# EAGLE design Joytick board single side (EAGLE 9.6.2)
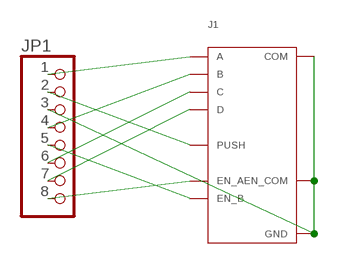
[diagram p0: schematic, sheet 1]

## Parts
J1  RKJXT1F42001  [RKJXT1F42001]
JP1  PINHD-1X08_2.54-SMD-90°  [1X08SMD/90]

## Nets
N$1: J1.A JP1.1
N$2: J1.PUSH JP1.2
N$3: J1.COM J1.ENCODER_COM(EN_COM) J1.GND JP1.3
N$4: J1.B JP1.4
N$5: J1.ENCODER_B(EN_B) JP1.5
N$6: J1.C JP1.6
N$7: J1.D JP1.7
N$8: J1.ENCODER_A(EN_A) JP1.8

## Library data of the parts
J1 = PP_Electromechanical:RKJXT1F42001
JP1 = pinhead-2:PINHD-1X08: PIN HEADER

## Board
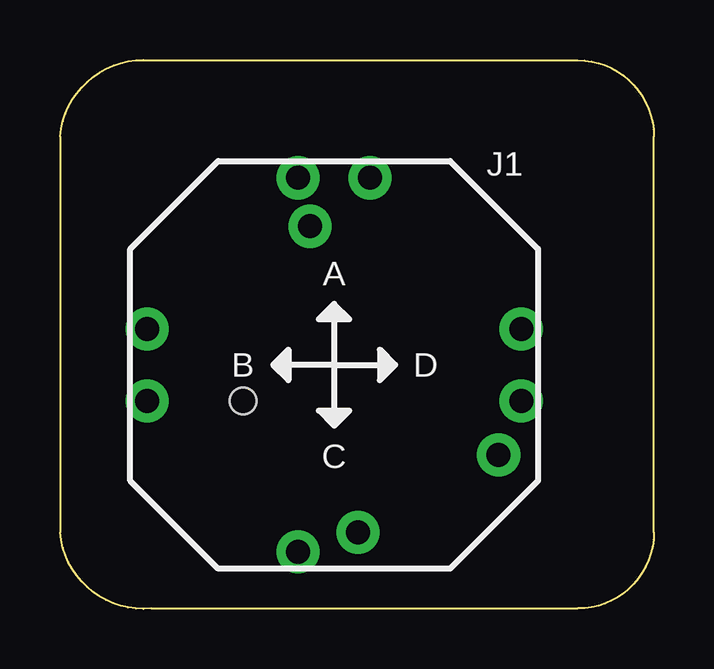
[diagram p1: board, top side]
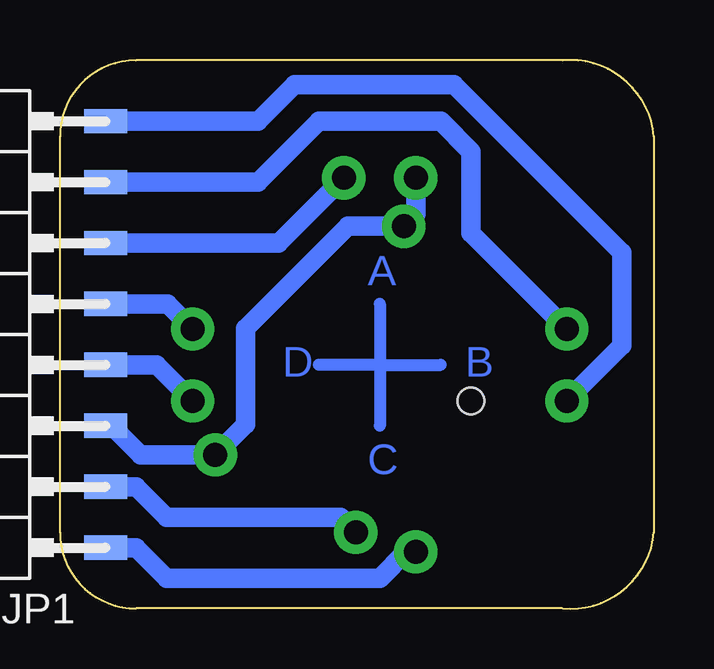
[diagram p2: board, bottom side, seen from below]

Size 24.77 x 22.89 mm. Coordinates in mm from the lower left corner, seen from the top.
Outline: 3.81,0.01 21.59,0.01 arc90 24.77,3.19 24.77,19.7 arc90 21.59,22.87 3.81,22.87 arc90 0,19.7 0,3.19 arc90 3.81,0.01
Copper layers (1*16): Top 0.035mm / dielectric 1.5mm / Bottom 0.035mm
Design rules "swidzi_milling_3018_tht_test": minimum track width 20mil, minimum drill 0.8mm, track to track 20mil, track to pad 20mil, pad to pad 24mil, via to via 6mil, smd to smd 6mil, copper to edge 15mil, drill to drill 6mil, minimum pad ring 10mil, minimum via ring 8mil, stop-mask expansion 4mil, vias tented up to drill 0mil, thermal gap 10mil

### Footprints (pad centres in the part's own frame; a part is rotated, then mirrored left to right if it is on the bottom)
RKJXT1F42001 = drill 1 pad 1.676: A -1.5,-7.8; B 7.8,-1.5; C 1.5,7.8; COM -1,5.78; D -7.8,1.5; ENCODER_A -7.8,-1.5; ENCODER_B 7.8,1.5; ENCODER_COM -1.5,7.8; GND 6.86,-3.75; PUSH 1,-6.98 | hole 1.1: -3.8,-1.5
1X08SMD/90 = smd 1.016 x 1.778: 1 -1.27,-5.08; 2 1.27,-5.08; 3 3.81,-5.08; 4 6.35,-5.08; 5 8.89,-5.08; 6 11.43,-5.08; 7 13.97,-5.08; 8 16.51,-5.08

### Placement (x,y rotation side)
J1  11.43,10.17 0 top
JP1  27.94,3.82 90 bottom

### Tracks (layer width: path | path; a pad name or v marks a point on that pad's centre or on a via)
N$1
  Bottom 0.508: J1.A 10.34,2.37
  Bottom 0.813: 10.34,2.37 11.43,1.28 20.32,1.28 21.59,2.55 JP1.1
N$2
  Bottom 0.508: J1.PUSH 13.06,3.82
  Bottom 0.813: JP1.2 21.59,5.09 20.32,3.82 13.06,3.82
N$3
  Bottom 0.813: JP1.3 22.61,7.63 21.4,6.42 J1.GND 17.02,7.7 17.02,11.7 12.76,15.95 J1.COM 9.93,16.45 J1.ENCODER_COM
N$4
  Bottom 0.813: J1.B 20.73,10.17 JP1.4
N$5
  Bottom 0.813: J1.ENCODER_B 20.27,12.71 JP1.5
N$6
  Bottom 0.813: J1.C 15.65,15.25 JP1.6
N$7
  Bottom 0.813: J1.D 7.62,15.66 7.62,19.06 8.89,20.33 13.97,20.33 16.51,17.79 JP1.7
N$8
  Bottom 0.508: 3.63,8.69 J1.ENCODER_A
  Bottom 0.813: JP1.8 16.51,20.33 14.99,21.86 8.34,21.86 1.33,14.85 1.33,10.99 3.63,8.69
N$9
  Bottom 0.508: 11.43,12.71 11.43,10.17 | 11.43,10.17 11.43,7.63 | 11.43,10.17 13.97,10.17 | 11.43,10.17 8.89,10.17

### Text on the board
Bottom: A | B | D | C